# Altium schematic sheet 5_电子天平_ESP32.SchDoc: 电子天平_ESP32
size A4; Date: 2020/01/07; ApprovedBy: Riggin; CheckedBy: Riggin; Author: Riggin; DrawnBy: Riggin; Engineer: Riggin; DocumentNumber: 6; Revision: V1.0; SheetNumber: 6; SheetTotal: 8; Time: 14:09:34; ProjectName: 电子天平
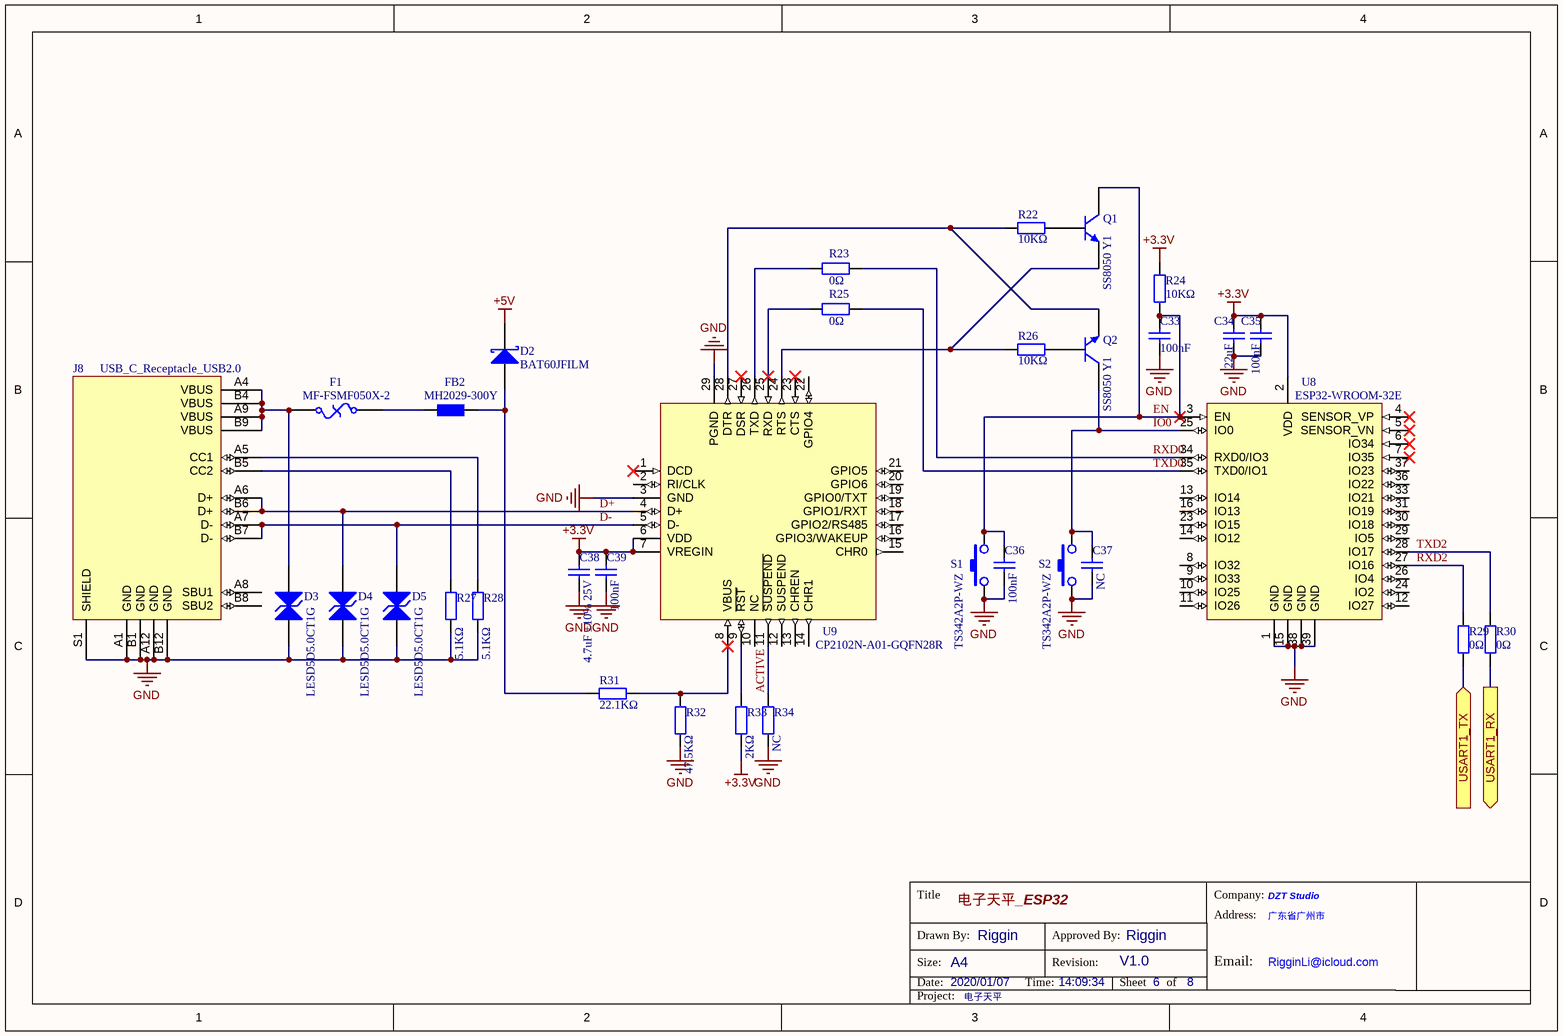
[diagram p0: 5_电子天平_ESP32.SchDoc]

## Parts
C33  100nF  [LC-0805_C]
C34  22uF  [LC-1206_C]
C35  100nF  [LC-0805_C]
C36  100nF  [LC-0805_C]
C37  NC  [LC-0805_C]
C38  4.7uF ±10% 25V  [LC-0805_C]
C39  100nF  [LC-0805_C]
D2  BAT60JFILM  [LC-SOD-323]
D3  LESD5D5.0CT1G  [LC-SOD-523]
D4  LESD5D5.0CT1G  [LC-SOD-523]
D5  LESD5D5.0CT1G  [LC-SOD-523]
F1  MF-FSMF050X-2  [LC-0603]
FB2  MH2029-300Y  [LC-0805_L]
J8  USB_C_Receptacle_USB2.0
Q1  SS8050 Y1  [LC-SOT-23(SOT-23-3)]
Q2  SS8050 Y1  [LC-SOT-23(SOT-23-3)]
R22  10KΩ  [LC-0805_R]
R23  0Ω  [LC-0805_R]
R24  10KΩ  [LC-0805_R]
R25  0Ω  [LC-0805_R]
R26  10KΩ  [LC-0805_R]
R27  5.1KΩ  [LC-0805_R]
R28  5.1KΩ  [LC-0805_R]
R29  0Ω  [LC-0805_R]
R30  0Ω  [LC-0805_R]
R31  22.1KΩ  [LC-0805_R]
R32  47.5KΩ  [LC-0805_R]
R33  2KΩ  [LC-0805_R]
R34  NC  [LC-0805_R]
S1  TS342A2P-WZ  [SW-REST-KEY]
S2  TS342A2P-WZ  [SW-REST-KEY]
U8  ESP32-WROOM-32E
U9  CP2102N-A01-GQFN28R  [LC-QFN-28_5x5x05P]

## Ports
USART1_RX (out), USART1_TX (in)

## Nets
+3.3V: C34.1 C35.1 C38.1 C39.1 R24.2 R33.1 U8.2(VDD) U9.6(VDD) U9.7(VREGIN)
+5V: D2.2(K)
GND: C33.2 C34.2 C35.2 C36.2 C37.2 C38.2 C39.2 D3.1(A) D4.1(A) D5.1(A) J8.A1(GND) J8.A12(GND) J8.B1(GND) J8.B12(GND) J8.S1(SHIELD) R27.2 R28.2 R32.1 R34.1 S1.1 S2.1 U8.1(GND) U8.15(GND) U8.38(GND) U8.39(GND) U9.3(GND) U9.29(PGND)
ACTIVE: R34.2 U9.11(~{SUSPEND})
D+: D4.2(K) J8.A6(D+) J8.B6(D+) U9.4(D+)
D-: D5.2(K) J8.A7(D-) J8.B7(D-) U9.5(D-)
EN: C33.1 C36.1 Q1.3(C) R24.1 S1.2 U8.3(EN)
IO0: C37.1 Q2.3(C) S2.2 U8.25(IO0)
RXD0: R23.1 U8.34(RXD0/IO3)
RXD2: R29.1 U8.27(IO16)
TXD0: R25.1 U8.35(TXD0/IO1)
TXD2: R30.1 U8.28(IO17)
USART1_RX: R30.2 ; port USART1_RX
USART1_TX: R29.2 ; port USART1_TX
NetD2_1: D2.1(A) FB2.2 R31.1
NetD3_2: D3.2(K) F1.2 J8.A4(VBUS) J8.A9(VBUS) J8.B4(VBUS) J8.B9(VBUS)
NetF1_1: F1.1 FB2.1
NetJ8_A5: J8.A5(CC1) R28.1
NetJ8_B5: J8.B5(CC2) R27.1
NetQ1_1: Q1.1(B) R22.1
NetQ1_2: Q1.2(E) R26.2 U9.24(RTS)
NetQ2_1: Q2.1(B) R26.1
NetQ2_2: Q2.2(E) R22.2 U9.28(DTR)
NetR23_2: R23.2 U9.26(TXD)
NetR25_2: R25.2 U9.25(RXD)
NetR31_2: R31.2 R32.2 U9.8(VBUS)
NetR33_2: R33.2 U9.9(~{RST})

Not connected (* = marked no-connect by the designer): J8 A8(SBU1) B8(SBU2); U8 4(SENSOR_VP)* 5(SENSOR_VN)* 6(IO34)* 7(IO35)* 8(IO32) 9(IO33) 10(IO25) 11(IO26) 12(IO27) 13(IO14) 14(IO12) 16(IO13) 17(NC) 18(NC) 19(NC) 20(NC) 21(NC) 22(NC) 23(IO15) 24(IO2) 26(IO4) 29(IO5) 30(IO18) 31(IO19) 32(NC) 33(IO21) 36(IO22) 37(IO23); U9 1(DCD)* 2(RI/CLK) 10(NC) 12(SUSPEND) 13(CHREN) 14(CHR1) 15(CHR0) 16(GPIO3/WAKEUP) 17(GPIO2/RS485) 18(GPIO1/RXT) 19(GPIO0/TXT) 20(GPIO6) 21(GPIO5) 22(GPIO4) 23(CTS)* 27(DSR)*

## Notes on the sheet
- Title
- Company:
- Address:
- 广东省广州市
- DZT Studio
- Size:
- Date:
- Drawn By:
- A4
- Riggin
- Time:
- Revision:
- Approved By:
- Sheet
- of
- Email:
- RigginLi@icloud.com
- Project:

## Library data of the parts
C33-C35 C38 C39 = Cap: MLCC; Value: 100pF; Published: 8-Jun-2000; LatestRevisionDate: 17-Jul-2002; LatestRevisionNote: Re-released for DXP Platform.; PackageReference: RAD-0.3; Publisher: Altium Limited; PackageDescription: Radial Cap, Thru-Hole; 2 Leads; 0.3 in Pin Spacing
C36 C37 = Cap: Capacitor-0.1uF±10%/50V; Value: 100pF; Published: 8-Jun-2000; LatestRevisionDate: 17-Jul-2002; LatestRevisionNote: Re-released for DXP Platform.; PackageReference: RAD-0.3; Publisher: Altium Limited; PackageDescription: Radial Cap, Thru-Hole; 2 Leads; 0.3 in Pin Spacing
D2 = D Schottky: Schottky Diode; Published: 8-Jun-2000; LatestRevisionDate: 17-Jul-2002; LatestRevisionNote: Re-released for DXP Platform.; PackageReference: SMB; Publisher: Altium Limited; Code_JEDEC: DO-214-AA
D3-D5 = SMB/DO-214AA P6SMB6.8CA: ESD二极管; ComponentLink1Description: 供应商链接; ComponentLink1URL: http://www.szlcsc.com/product/details_79530.html; Package: SMB/DO-214AA; Supplier: LC; SuppliersPartNumber: C78395
F1 = Fuse Thermal: 自恢复保险丝; Published: 24-Mar-1999; LatestRevisionDate: 17-Jul-2002; LatestRevisionNote: Re-released for DXP Platform.; PackageReference: PIN-W2/E2.8; Publisher: Altium Limited
FB2 = FB: 磁珠
J8 = USB_C_Receptacle_USB2.0: USB TypeC 连接器
Q1 Q2 = SOT-23 SS8050 Y1: 三极管; ComponentLink1Description: 供应商链接; ComponentLink1URL: http://www.szlcsc.com/product/details_2507.html; Package: SOT-23; Supplier: LC; SuppliersPartNumber: C2150
R22-R34 = Res2: Resistor; Value: 1K; Published: 8-Jun-2000; LatestRevisionDate: 17-Jul-2002; LatestRevisionNote: Re-released for DXP Platform.; PackageReference: AXIAL-0.4; Publisher: Altium Limited; PackageDescription: Axial Device, Thru-Hole; 2 Leads; 0.4 in Pin Spacing
S1 S2 = SW: Tact Switch; 高?: 7mm
U8 = ESP32-WROOM-32E: ESP32模组
U9 = CP2102N-A01-GQFN28R: USB芯片